# EAGLE design Micropressure-XIAO-XBee (EAGLE 9.6.2)
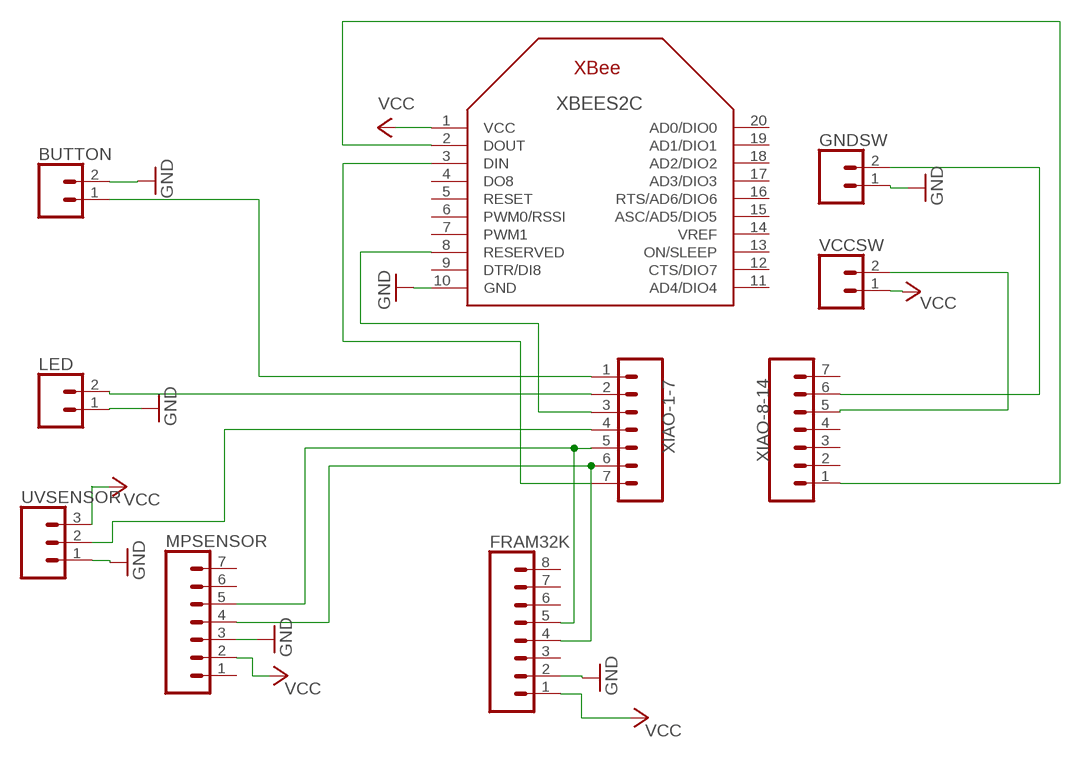
[diagram p0: schematic, sheet 1]

## Parts
BUTTON  button  CONN_02  [1X02]
FRAM32K  FRAM32K  CONN_08"  [1X08]
GNDSW  button  CONN_02  [1X02]
LED  LED  CONN_02  [1X02]
MPSENSOR  mpsensor  CONN_07  [1X07]
UVSENSOR  UV Sensor  CONN_03  [1X03]
VCCSW  button  CONN_02  [1X02]
XBEES2C  XBEE  [XBEE]
XIAO-1-7  CONN_07  [1X07]
XIAO-8-14  CONN_07  [1X07]

## Nets
GND: BUTTON.2 FRAM32K.2 GNDSW.1 LED.1 MPSENSOR.3 UVSENSOR.1 XBEES2C.10(GND)
N$1: FRAM32K.5 MPSENSOR.5 XIAO-1-7.5
N$2: FRAM32K.4 MPSENSOR.4 XIAO-1-7.6
N$3: XBEES2C.3(DIN) XIAO-1-7.7
N$4: GNDSW.2 XIAO-8-14.6
N$5: XBEES2C.8(RESERVED) XIAO-1-7.3
N$6: UVSENSOR.2 XIAO-1-7.4
N$7: BUTTON.1 XIAO-1-7.1
N$8: LED.2 XIAO-1-7.2
N$9: XBEES2C.2(DOUT) XIAO-8-14.1
N$10: VCCSW.2 XIAO-8-14.5
VCC: FRAM32K.1 MPSENSOR.2 UVSENSOR.3 VCCSW.1 XBEES2C.1(VCC)
Unconnected: FRAM32K.3 FRAM32K.6 FRAM32K.7 FRAM32K.8 MPSENSOR.1 MPSENSOR.6 MPSENSOR.7 XBEES2C.4(DO8) XBEES2C.5(RESET) XBEES2C.6(PWM0/RSSI) XBEES2C.7(PWM1) XBEES2C.9(DTR/DI8) XBEES2C.11(AD4/DIO4) XBEES2C.12(CTS/DIO7) XBEES2C.13(ON/SLEEP) XBEES2C.14(VREF) XBEES2C.15(ASC/AD5/DIO5) XBEES2C.16(RTS/AD6/DIO6) XBEES2C.17(AD3/DIO3) XBEES2C.18(AD2/DIO2) XBEES2C.19(AD1/DIO1) XBEES2C.20(AD0/DIO0) XIAO-8-14.2 XIAO-8-14.3 XIAO-8-14.4 XIAO-8-14.7

## Library data of the parts
BUTTON GNDSW LED VCCSW = SparkFun-Connectors:CONN_02: Multi connection point. Often used as Generic Header-pin footprint for 0.1 inch spaced/style header connections On any of the 0.1 inch spaced packages, you can populate with these: Break Away Headers - Straight <https://www.sparkfun.com/products/116> (PRT-00116) Break Away Male Headers - Right Angle <https://www.sparkfun.com/products/553> (PRT-00553) Female Headers <https://www.sparkfun.com/products/115> (PRT-00115) Break Away Headers - Machine Pin <https://www.sparkfun.com/products/117> (PRT-00117) Break Away Female Headers - Swiss Machine Pin <https://www.sparkfun.com/products/743> (PRT-00743) For SCREWTERMINALS and SPRING TERMINALS visit here: Screw Terimnals on SparkFun.com <https://www.sparkfun.com/search/results?term=Screw+Terminals> (5mm/3.5mm/2.54mm spacing) This device is also useful as a general connection point to wire up your design to another part of your project. Our various solder wires solder well into these plated through hole pads. Hook-Up Wire - Assortment (Stranded, 22 AWG) <https://www.sparkfun.com/products/11375> (PRT-11375) Hook-Up Wire - Assortment (Solid Core, 22 AWG) <https://www.sparkfun.com/products/11367> (PRT-11367) View the entire wire category on our website here <https://www.sparkfun.com/categories/141> Special notes: Molex polarized connector foot print use with: PRT-08233 with associated crimp pins and housings. 2.54_SCREWTERM for use with PRT-10571. 3.5mm Screw Terminal footprints for PRT-08084 5mm Screw Terminal footprints for use with PRT-08432
FRAM32K = SparkFun-Connectors:CONN_08: Multi connection point. Often used as Generic Header-pin footprint for 0.1 inch spaced/style header connections On any of the 0.1 inch spaced packages, you can populate with these: Break Away Headers - Straight <https://www.sparkfun.com/products/116> (PRT-00116) Break Away Male Headers - Right Angle <https://www.sparkfun.com/products/553> (PRT-00553) Female Headers <https://www.sparkfun.com/products/115> (PRT-00115) Break Away Headers - Machine Pin <https://www.sparkfun.com/products/117> (PRT-00117) Break Away Female Headers - Swiss Machine Pin <https://www.sparkfun.com/products/743> (PRT-00743) Arduino Stackable Header - 8 Pin <https://www.sparkfun.com/products/9279> (PRT-09279) For SCREWTERMINALS and SPRING TERMINALS visit here: Screw Terimnals on SparkFun.com <https://www.sparkfun.com/search/results?term=Screw+Terminals> (5mm/3.5mm/2.54mm spacing) This device is also useful as a general connection point to wire up your design to another part of your project. Our various solder wires solder well into these plated through hole pads. Hook-Up Wire - Assortment (Stranded, 22 AWG) <https://www.sparkfun.com/products/11375> (PRT-11375) Hook-Up Wire - Assortment (Solid Core, 22 AWG) <https://www.sparkfun.com/products/11367> (PRT-11367) View the entire wire category on our website here <https://www.sparkfun.com/categories/141> Special notes: Molex polarized connector foot print use with SKU : PRT-08231 with associated crimp pins and housings. 1MM SMD Version SKU: PRT-10208 NOTES ON THE VARIANTS LOCK and LOCK_LONGPADS... This footprint was designed to help hold the alignment of a through-hole component (i.e. 6-pin header) while soldering it into place. You may notice that each hole has been shifted either up or down by 0.005 of an inch from it's more standard position (which is a perfectly straight line). This slight alteration caused the pins (the squares in the middle) to touch the edges of the holes. Because they are alternating, it causes a "brace" to hold the component in place. 0.005 has proven to be the perfect amount of "off-center" position when using our standard breakaway headers. Although looks a little odd when you look at the bare footprint, once you have a header in there, the alteration is very hard to notice. Also,if you push a header all the way into place, it is covered up entirely on the bottom side.; PROD_ID: CONN-08438
MPSENSOR XIAO-1-7 XIAO-8-14 = SparkFun-Connectors:CONN_07: Multi connection point. Often used as Generic Header-pin footprint for 0.1 inch spaced/style header connections On any of the 0.1 inch spaced packages, you can populate with these: Break Away Headers - Straight <https://www.sparkfun.com/products/116> (PRT-00116) Break Away Male Headers - Right Angle <https://www.sparkfun.com/products/553> (PRT-00553) Female Headers <https://www.sparkfun.com/products/115> (PRT-00115) Break Away Headers - Machine Pin <https://www.sparkfun.com/products/117> (PRT-00117) Break Away Female Headers - Swiss Machine Pin <https://www.sparkfun.com/products/743> (PRT-00743) For SCREWTERMINALS and SPRING TERMINALS visit here: Screw Terimnals on SparkFun.com <https://www.sparkfun.com/search/results?term=Screw+Terminals> (5mm/3.5mm/2.54mm spacing) This device is also useful as a general connection point to wire up your design to another part of your project. Our various solder wires solder well into these plated through hole pads. Hook-Up Wire - Assortment (Stranded, 22 AWG) <https://www.sparkfun.com/products/11375> (PRT-11375) Hook-Up Wire - Assortment (Solid Core, 22 AWG) <https://www.sparkfun.com/products/11367> (PRT-11367) View the entire wire category on our website here <https://www.sparkfun.com/categories/141> Special notes: Molex polarized connector foot print use with SKU : PRT-08231 with associated crimp pins and housings. 1MM SMD Version SKU: PRT-10208 NOTES ON THE VARIANTS LOCK and LOCK_LONGPADS... This footprint was designed to help hold the alignment of a through-hole component (i.e. 6-pin header) while soldering it into place. You may notice that each hole has been shifted either up or down by 0.005 of an inch from it's more standard position (which is a perfectly straight line). This slight alteration caused the pins (the squares in the middle) to touch the edges of the holes. Because they are alternating, it causes a "brace" to hold the component in place. 0.005 has proven to be the perfect amount of "off-center" position when using our standard breakaway headers. Although looks a little odd when you look at the bare footprint, once you have a header in there, the alteration is very hard to notice. Also,if you push a header all the way into place, it is covered up entirely on the bottom side.
UVSENSOR = SparkFun-Connectors:CONN_03: Multi connection point. Often used as Generic Header-pin footprint for 0.1 inch spaced/style header connections On any of the 0.1 inch spaced packages, you can populate with these: Break Away Headers - Straight <https://www.sparkfun.com/products/116> (PRT-00116) Break Away Male Headers - Right Angle <https://www.sparkfun.com/products/553> (PRT-00553) Female Headers <https://www.sparkfun.com/products/115> (PRT-00115) Break Away Headers - Machine Pin <https://www.sparkfun.com/products/117> (PRT-00117) Break Away Female Headers - Swiss Machine Pin <https://www.sparkfun.com/products/743> (PRT-00743) Stackable Header - 3 Pin (Female, 0.1") <https://www.sparkfun.com/products/13875> (PRT-13875) For SCREWTERMINALS and SPRING TERMINALS visit here: Screw Terimnals on SparkFun.com <https://www.sparkfun.com/search/results?term=Screw+Terminals> (5mm/3.5mm/2.54mm spacing) This device is also useful as a general connection point to wire up your design to another part of your project. Our various solder wires solder well into these plated through hole pads. Hook-Up Wire - Assortment (Stranded, 22 AWG) <https://www.sparkfun.com/products/11375> (PRT-11375) Hook-Up Wire - Assortment (Solid Core, 22 AWG) <https://www.sparkfun.com/products/11367> (PRT-11367) View the entire wire category on our website here <https://www.sparkfun.com/categories/141> Special notes: Molex polarized connector foot print use with SKU : PRT-08232 with associated crimp pins and housings.; PROD_ID: XXX-00000; VALUE: 455-1750-1-ND
XBEES2C = adafruit:XBEE

## Net classes
0 default: width 0.305 mm, drill 0.508 mm, clearance 0.508 mm

## Board
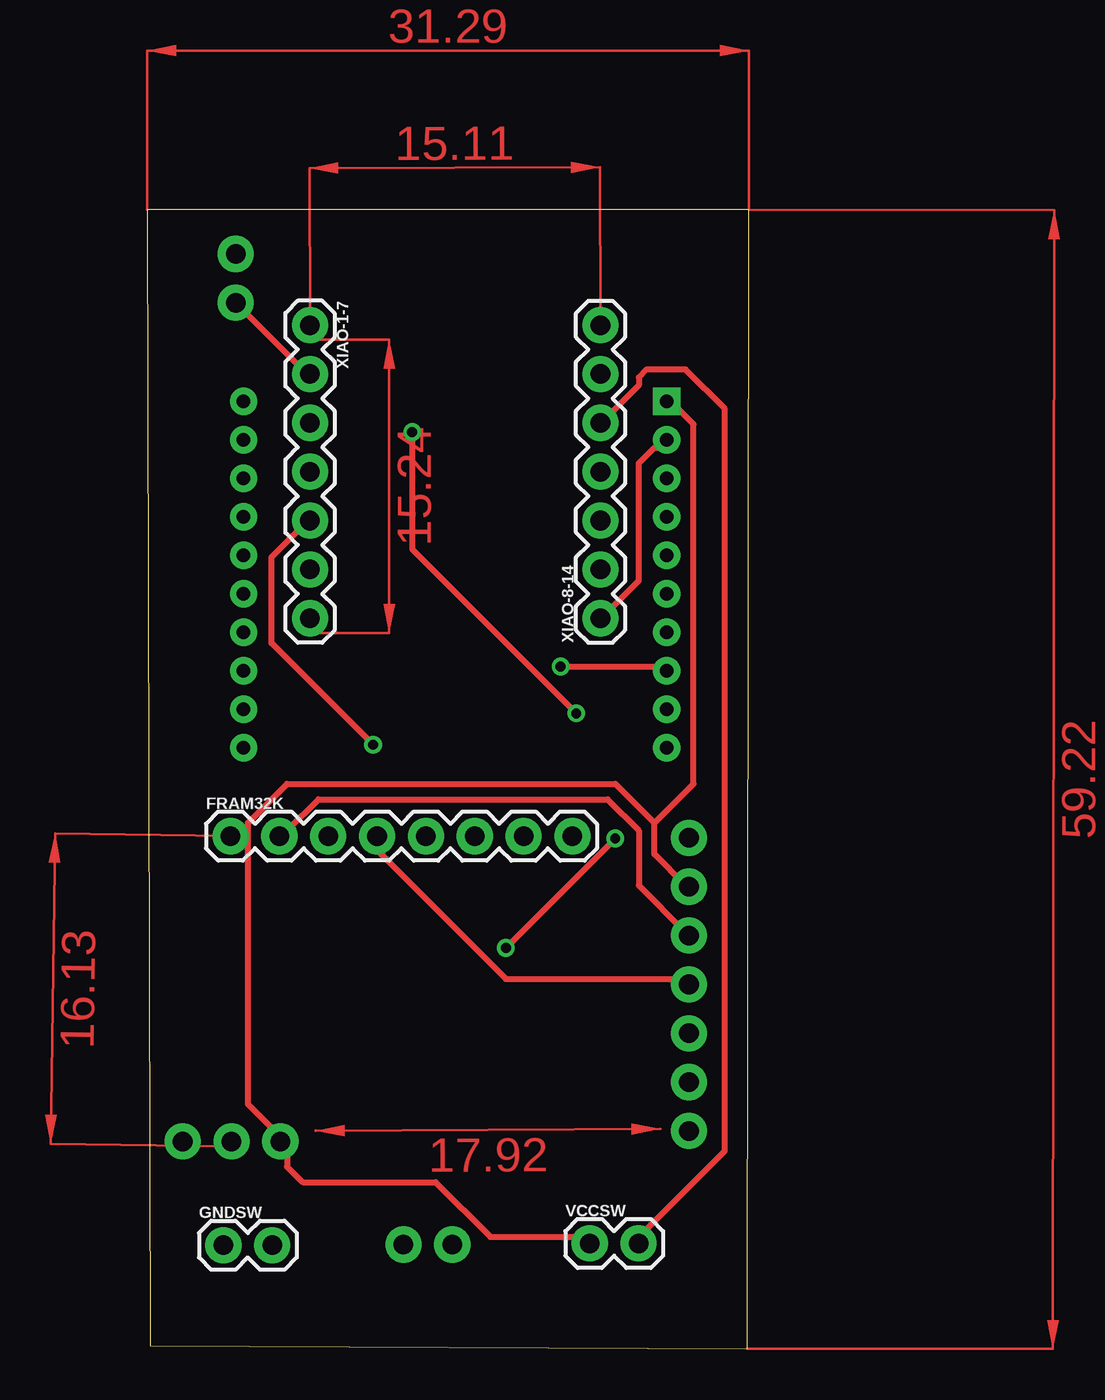
[diagram p1: board, top side]
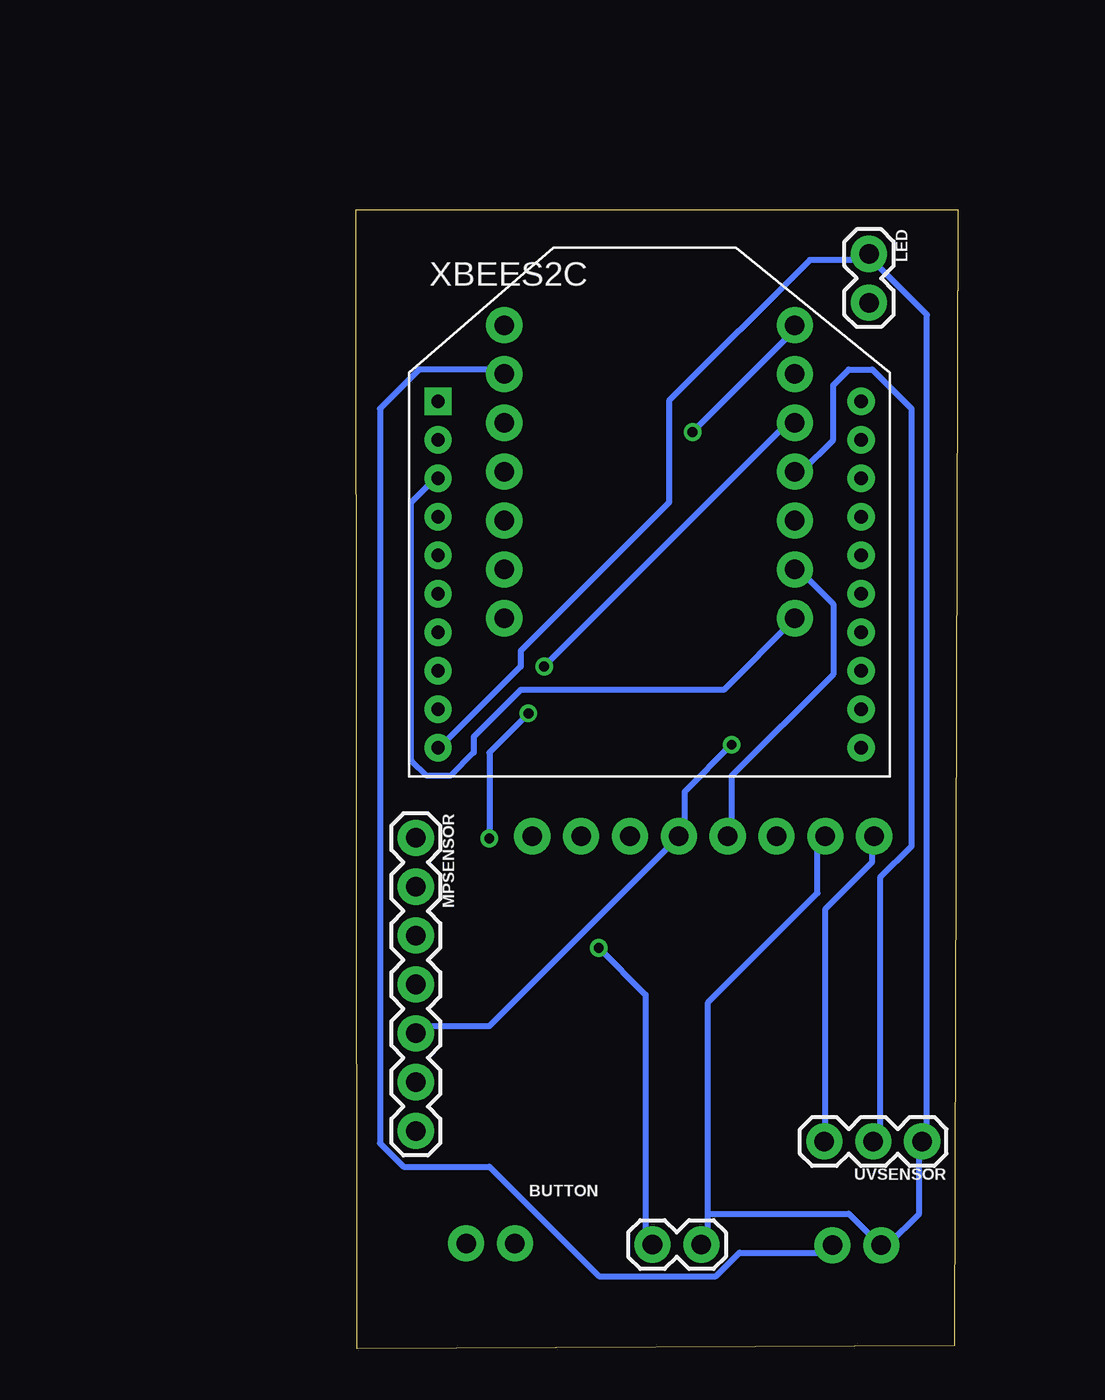
[diagram p2: board, bottom side, seen from below]

Size 31.29 x 59.22 mm. Coordinates in mm from the lower left corner, seen from the top.
Outline: 0.17,0.15 31.23,0 31.29,59.22 0,59.22 0.17,0.15
Copper layers (1*16): Top 0.035mm / dielectric 1.5mm / Bottom 0.035mm
Design rules "default": minimum track width 6mil, minimum drill 0.35mm, track to track 6mil, track to pad 6mil, pad to pad 6mil, via to via 6mil, smd to smd 6mil, copper to edge 40mil, drill to drill 6mil, minimum pad ring 10mil, minimum via ring 8mil, stop-mask expansion 4mil, vias tented up to drill 0mil, thermal gap 10mil

### Footprints (pad centres in the part's own frame; a part is rotated, then mirrored left to right if it is on the bottom)
1X02 = drill 1.016 pad 1.88: 1 0,0; 2 2.54,0
1X08 = drill 1.016 pad 1.88: 1 0,0; 2 2.54,0; 3 5.08,0; 4 7.62,0; 5 10.16,0; 6 12.7,0; 7 15.24,0; 8 17.78,0
1X07 = drill 1.016 pad 1.88: 1 0,0; 2 2.54,0; 3 5.08,0; 4 7.62,0; 5 10.16,0; 6 12.7,0; 7 15.24,0
1X03 = drill 1.016 pad 1.88: 1 0,0; 2 2.54,0; 3 5.08,0
XBEE = drill 0.7 pad 1.422 square: 1 -11,5.5 | drill 0.7 pad 1.422: 2 -11,3.5; 3 -11,1.5; 4 -11,-0.5; 5 -11,-2.5; 6 -11,-4.5; 7 -11,-6.5; 8 -11,-8.5; 9 -11,-10.5; 10 -11,-12.5; 11 11,-12.5; 12 11,-10.5; 13 11,-8.5; 14 11,-6.5; 15 11,-4.5; 16 11,-2.5; 17 11,-0.5; 18 11,1.5; 19 11,3.5; 20 11,5.5

### Placement (x,y rotation side)
BUTTON  15.87,5.41 0 bottom
FRAM32K  4.34,26.65 0 top
GNDSW  3.97,5.38 0 top
LED  4.61,56.93 270 bottom
MPSENSOR  28.18,26.56 270 bottom
UVSENSOR  1.85,10.77 180 bottom
VCCSW  23.02,5.47 0 top
XBEES2C  16.02,43.75 0 bottom
XIAO-1-7  8.47,53.22 270 top
XIAO-8-14  23.58,37.98 90 top

### Tracks (layer width: path | path; a pad name or v marks a point on that pad's centre or on a via)
GND
  Top 0.305: MPSENSOR.3 28.01,21.65 25.57,24.09 25.57,26.93 23.95,28.56 8.91,28.56 7.28,26.93 FRAM32K.2
  Bottom 0.305: XBEES2C.10 26.79,31.41 22.73,35.47 22.73,36.28 15,44 15,49.29 7.69,56.6 4.84,56.6 LED.1 4.44,56.6 1.59,53.76 1.59,11.09 UVSENSOR.1 2,10.68 2,7.02 3.62,5.4 GNDSW.1 4.03,5.4 5.66,7.02 12.97,7.02 | 12.97,7.02 12.97,5.8 BUTTON.2 | 12.97,7.02 12.97,17.99 7.28,23.68 7.28,26.53 FRAM32K.2
N$1  (via drill 0.51)
  Top 0.305: v11.75,31.41 6.47,36.69 6.47,41.16 8.1,42.78 XIAO-1-7.5
  Bottom 0.305: MPSENSOR.5 28.01,16.78 24.35,16.78 14.6,26.53 FRAM32K.5 14.19,26.93 14.19,28.97 v11.75,31.41
N$2
  Top 0.305: MPSENSOR.4 28.01,19.21 18.66,19.21 12.16,25.72 12.16,26.53 FRAM32K.4
  Bottom 0.305: FRAM32K.4 11.75,26.93 11.75,29.78 6.47,35.06 6.47,38.72 8.1,40.35 XIAO-1-7.6
N$3
  Bottom 0.305: XBEES2C.3 27.2,45.22 28.42,44 28.42,30.59 27.6,29.78 26.38,29.78 25.16,31 25.16,31.81 22.73,34.25 12.16,34.25 8.5,37.91 XIAO-1-7.7
N$4
  Bottom 0.305: GNDSW.2 6.88,4.99 11.35,4.99 12.57,3.77 18.66,3.77 24.35,9.46 28.82,9.46 30.04,10.68 30.04,48.88 28.01,50.91 23.95,50.91 XIAO-8-14.6
N$5  (via drill 0.51)
  Top 0.305: v21.51,35.47 26.79,35.47 XBEES2C.8
  Bottom 0.305: v21.51,35.47 8.5,48.47 XIAO-1-7.3
N$6
  Bottom 0.305: UVSENSOR.2 4.03,11.09 4.03,24.5 2.41,26.12 2.41,48.88 4.44,50.91 5.66,50.91 6.47,50.1 6.47,47.26 8.1,45.63 XIAO-1-7.4
N$7  (via drill 0.51)
  Top 0.305: v24.35,26.53 v18.66,20.84 | v22.32,33.03 13.79,41.57 v13.79,47.66
  Bottom 0.305: v18.66,20.84 16.22,18.4 16.22,5.8 BUTTON.1 | v24.35,26.53 24.35,31 v22.32,33.03 | v13.79,47.66 8.5,52.95 XIAO-1-7.1
N$8
  Top 0.305: XIAO-1-7.2 8.1,50.91 4.84,54.16 LED.2
N$9
  Top 0.305: XBEES2C.2 26.79,46.85 26.38,46.85 25.57,46.04 25.57,39.94 23.95,38.31 XIAO-8-14.1
N$10
  Top 0.305: XIAO-8-14.5 23.95,48.47 25.57,50.1 25.57,50.51 25.98,50.91 28.01,50.91 30.04,48.88 30.04,10.27 25.57,5.8 VCCSW.2
VCC
  Top 0.305: 26.38,27.34 28.42,29.37 28.42,48.07 27.6,48.88 27.2,48.88 XBEES2C.1 | 26.38,27.34 26.38,25.72 28.01,24.09 MPSENSOR.2 | VCCSW.1 22.73,5.8 17.85,5.8 15,8.65 8.1,8.65 7.28,9.46 7.28,10.68 UVSENSOR.3 6.88,11.09 5.25,12.71 5.25,27.34 7.28,29.37 24.35,29.37 26.38,27.34
  Bottom 0.305: FRAM32K.1 4.44,26.53 4.44,25.31 6.88,22.87 6.88,11.09 UVSENSOR.3
(copper drawn outside any net)
  shapes: Top area x6